# Altium schematic sheet ContactorDrive.SchDoc: Contactor Drive
size A; SheetNumber: 3; SheetTotal: 3
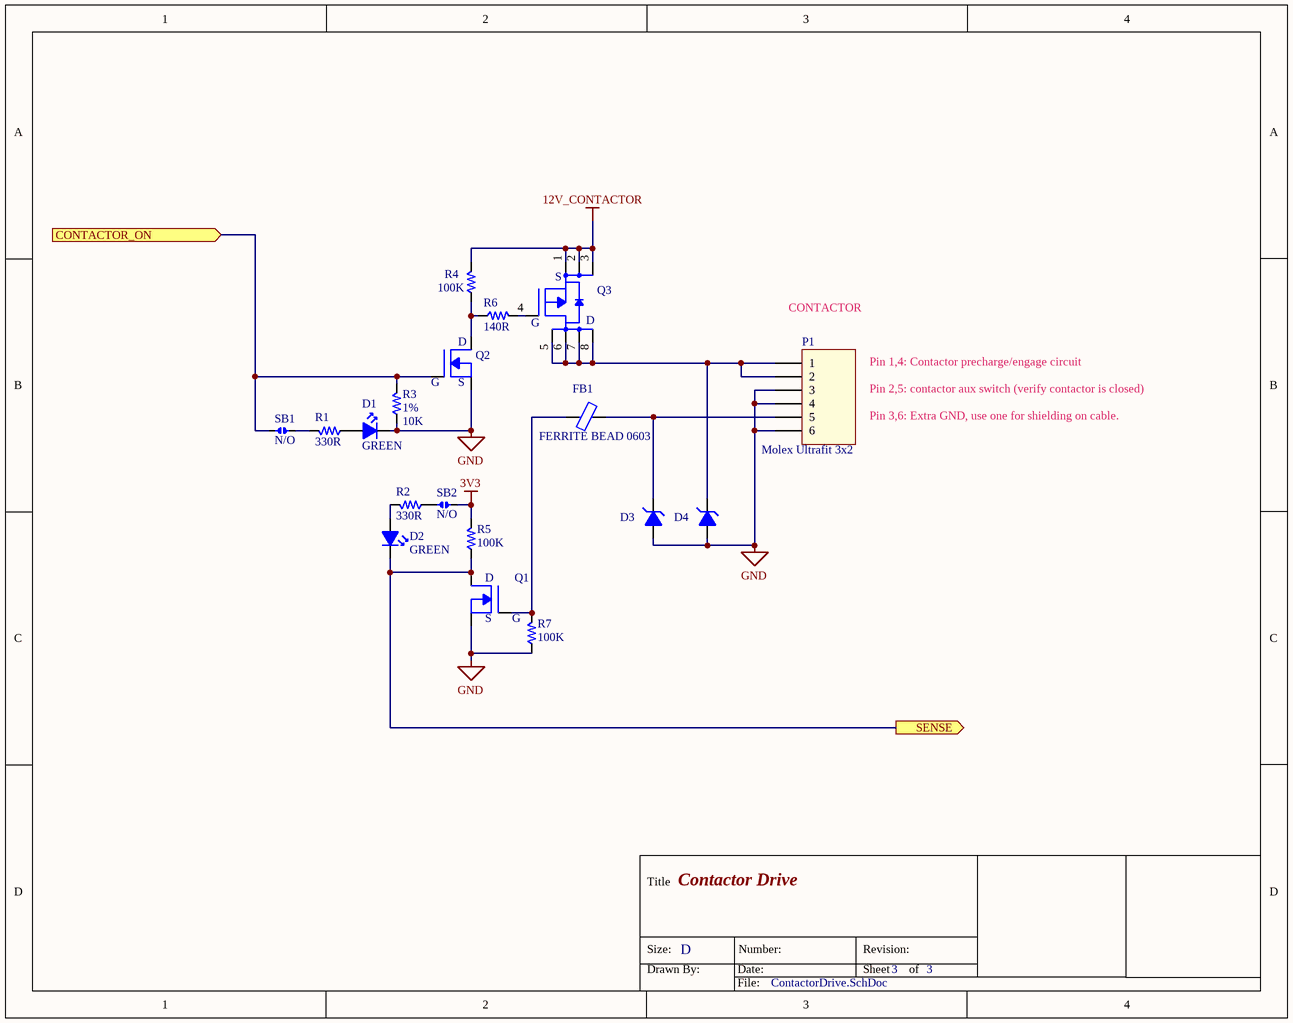
[diagram p0: ContactorDrive.SchDoc]

## Parts
D1  Color: GREEN  [SMD_0603_LED]  (hidden comment: D060-000G2-00)
D2  Color: GREEN  [SMD_0603_LED]  (hidden comment: D060-000G2-00)
D3  TVS_14V_UNI  [SODFL370X108-2N]  (value not drawn)
D4  TVS_14V_UNI  [SODFL370X108-2N]  (value not drawn)
FB1  FERRITE BEAD 0603  [INDC1608X10N]
P1  Molex Ultrafit 3x2  [Molex-Ultrafit-3x2]
Q1  NMOS - SSM3K333R  [NMOS - SSM3K333R - SOTFL95P180X88-3M]  (value not drawn)
Q2  NMOS - SSM3K333R  [NMOS - SSM3K333R - SOTFL95P180X88-3M]  (value not drawn)
Q3  INFINEON BSC030P03NS3 G  [BSC030P03NS3 G]  (value not drawn)
R1  value 330R  [PCB_GENERIC_SMD_0603]  (hidden comment: R060-00331-05)
R2  value 330R  [PCB_GENERIC_SMD_0603]  (hidden comment: R060-00331-05)
R3  value 10K  Tolerance: 1%  [PCB_GENERIC_SMD_0603]  (hidden comment: R060-00103-01)
R4  value 100K  [PCB_GENERIC_SMD_0603]  (hidden comment: R060-00104-05)
R5  value 100K  [PCB_GENERIC_SMD_0603]  (hidden comment: R060-00104-05)
R6  value 140R  [PCB_GENERIC_SMD_0603]  (hidden comment: R060-00141-05)
R7  value 100K  [PCB_GENERIC_SMD_0603]  (hidden comment: R060-00104-05)
SB1  N/O  [SB_ARROW_NC]  (no BOM)
SB2  N/O  [SB_ARROW_NC]  (no BOM)

## Ports
CONTACTOR_ON (in), SENSE (out)

## Nets
3V3: R5.2 SB2.2
12V_CONTACTOR: Q3.1(S) Q3.2(S) Q3.3(S) R4.2
GND: D1.1(K) D3.2(A) D4.2(A) P1.3 P1.4 P1.6 Q1.2(S) Q2.2(S) R3.1 R7.1
CONTACTOR_ON: Q2.1(G) R3.2 SB1.1 ; port CONTACTOR_ON
SENSE: D2.1(K) Q1.3(D) R5.1 ; port SENSE
NetD1_2: D1.2(A) R1.1
NetD2_2: D2.2(A) R2.2
NetD3_1: D3.1(C) FB1.2 P1.5
NetD4_1: D4.1(C) P1.1 P1.2 Q3.5(D) Q3.6(D) Q3.7(D) Q3.8(D)
NetFB1_1: FB1.1 Q1.1(G) R7.2
NetQ2_3: Q2.3(D) R4.1 R6.1
NetQ3_4: Q3.4(G) R6.2
NetR1_2: R1.2 SB1.2
NetR2_1: R2.1 SB2.1

## Notes on the sheet
- (near P1) CONTACTOR
- Pin 1,4: Contactor precharge/engage circuit
- Pin 2,5: contactor aux switch (verify contactor is closed)
- Pin 3,6: Extra GND, use one for shielding on cable.
- Title
- Size:
- Drawn By:
- D
- Date:
- Number:
- Revision:
- Sheet
- of
- File:

## Library data of the parts
D1 D2 = D060-000G2-00: LED 0603 GREEN 3.2Vf 20mA; Supplier 1: Digi-Key; Supplier Part Number 1: 732-4971-1-ND
D3 D4 = TVS_14V_UNI: TVS DIODE 14VWM 23.2VC SMF; Supplier 1: Digi-Key; Supplier Part Number 1: SMF14A-E3-08GICT-ND
FB1 = 0603_FERRITE_600Ohm: Ferrite Bead, 0603, 600Ohm @ 100MHz, 200mOhm DC; Supplier 1: Digi-Key; Supplier 2: Newark; Supplier Part Number 1: MH1608-601YCT-ND; Supplier Part Number 2: 87W5975
P1 = Molex-Ultrafit-3x2: Molex Ultrafit 3x2 - 172299-1206
Q1 Q2 = NMOS - SSM3K333R: MOSFET N CH 30V 6A 2-3Z1A; Supplier 1: Digi-Key; Supplier Part Number 1: SSM3K333RLFDKR-ND
Q3 = BSC030P03NS3 G: P-Channel 30V 25.4A (Ta), 100A (Tc) 2.5W (Ta), 125W (Tc) Surface Mount PG-TDSON-8; Supplier 1: Digi-Key; Supplier Part Number 1: BSC030P03NS3 GCT-ND
R1 R2 = R060-00331-05: RES 0603 330ohm 5% 63mW; Tolerance: 5%; Power: 63mW; Package: 0603
R3 = R060-00103-01: RES 0603 10K 1% 100mW; Power: 100mW; Package: 0603
R4 R5 R7 = R060-00104-05: RES 0603 100K 5% 63mW; Tolerance: 5%; Power: 63mW; Package: 0603
R6 = R060-00141-05: RES 0603 140ohm 5% 63mW; Tolerance: 5%; Power: 63mW; Package: 0603
SB1 SB2 = SB_NO: Solder Bridge, Normally Open